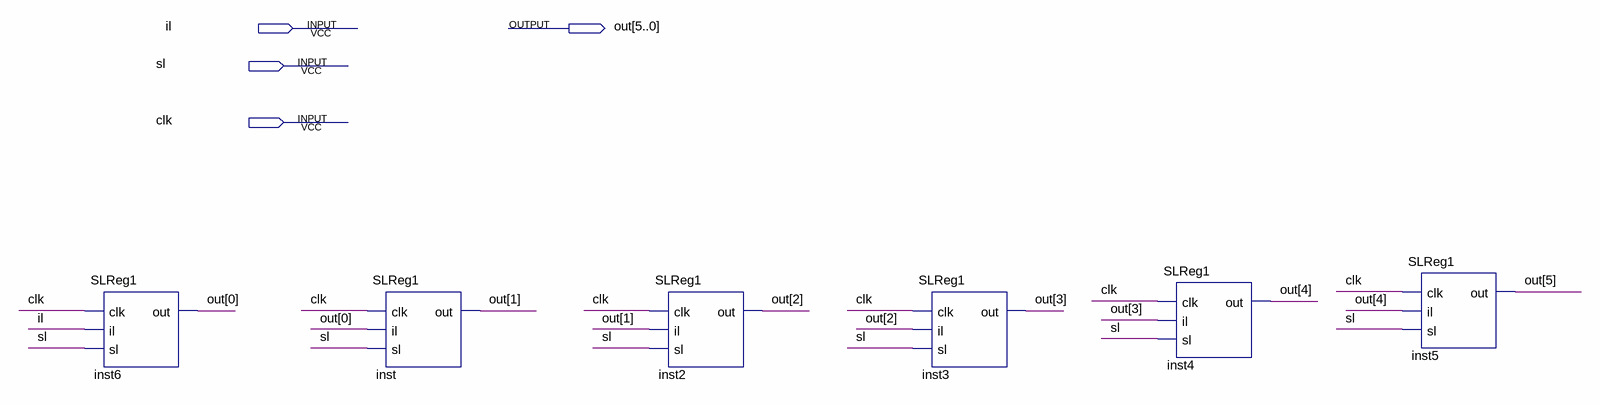
[diagram p0: schematic sheet]
// Quartus schematic SLReg6.bdf as structural Verilog: 6 symbols, 4 pins
module SLReg6 (
  input  il,
  input  sl,
  input  clk,
  output [5:0] out
);

  SLReg1 inst6 (.clk(clk), .il(il), .sl(sl), .out(out[0]));
  SLReg1 inst (.clk(clk), .il(out[0]), .sl(sl), .out(out[1]));
  SLReg1 inst2 (.clk(clk), .il(out[1]), .sl(sl), .out(out[2]));
  SLReg1 inst3 (.clk(clk), .il(out[2]), .sl(sl), .out(out[3]));
  SLReg1 inst4 (.clk(clk), .il(out[3]), .sl(sl), .out(out[4]));
  SLReg1 inst5 (.clk(clk), .il(out[4]), .sl(sl), .out(out[5]));
endmodule
